# EAGLE board main_board (EAGLE 7.1.0)
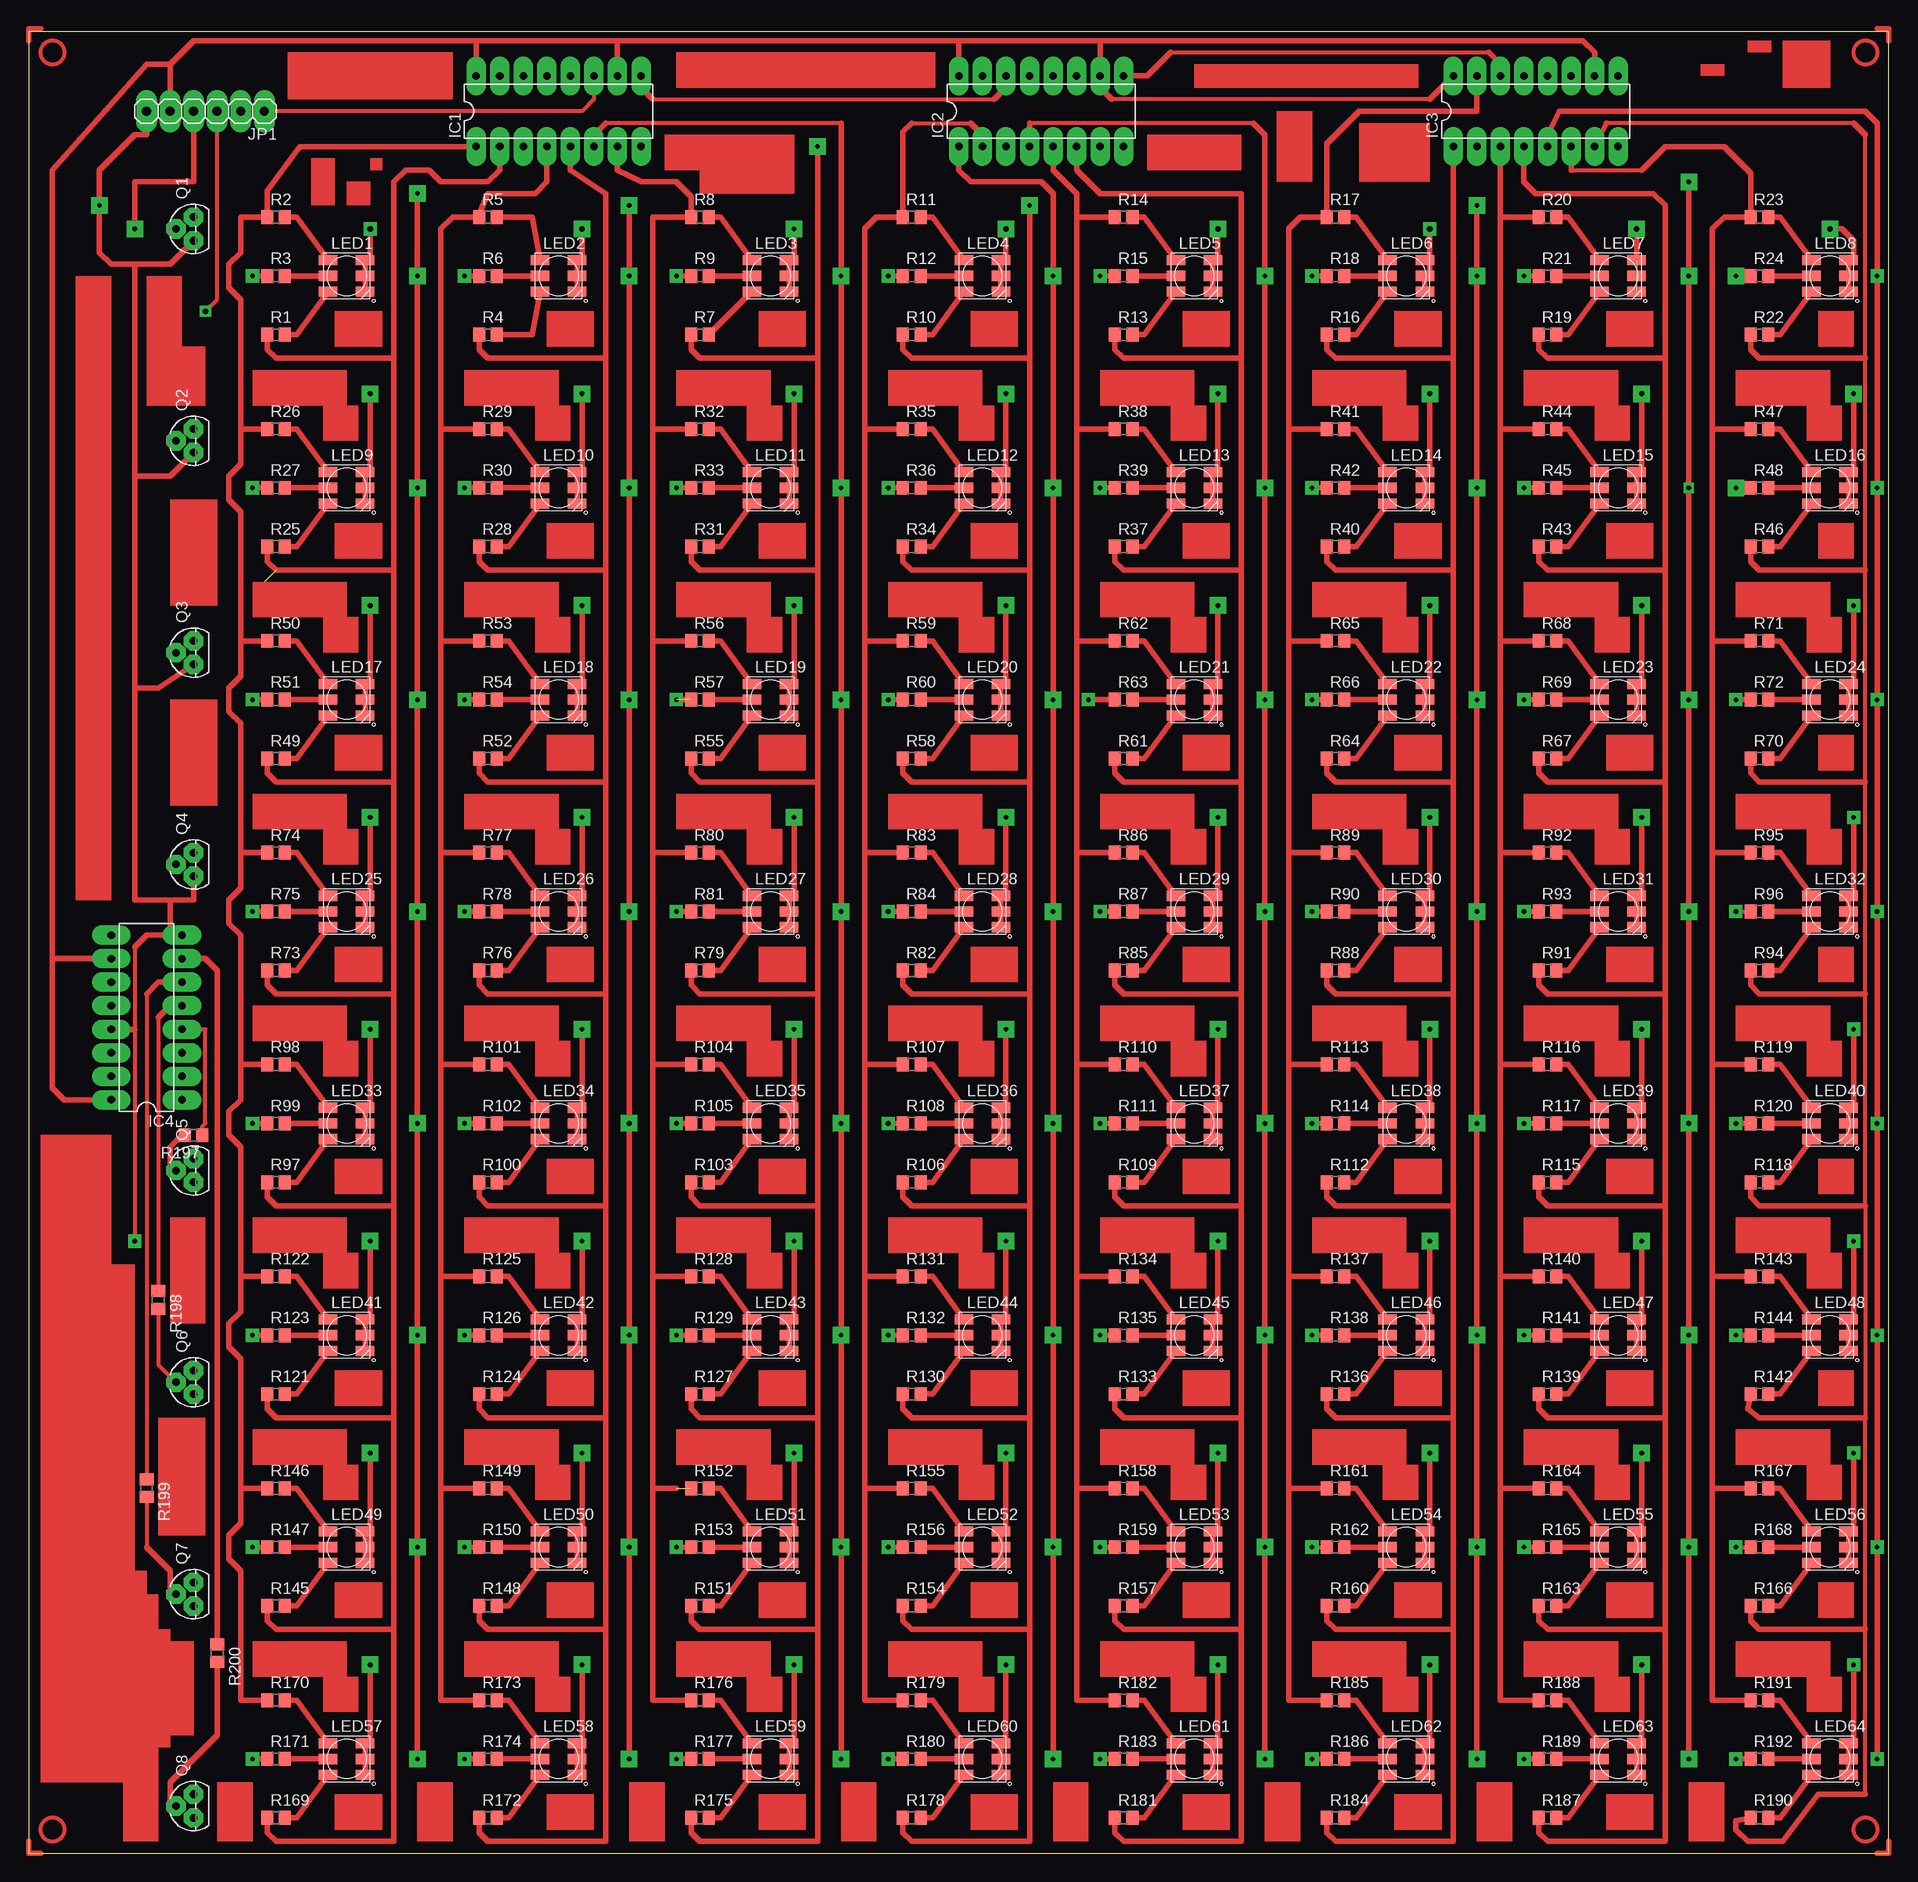
[diagram p1: board, top side]
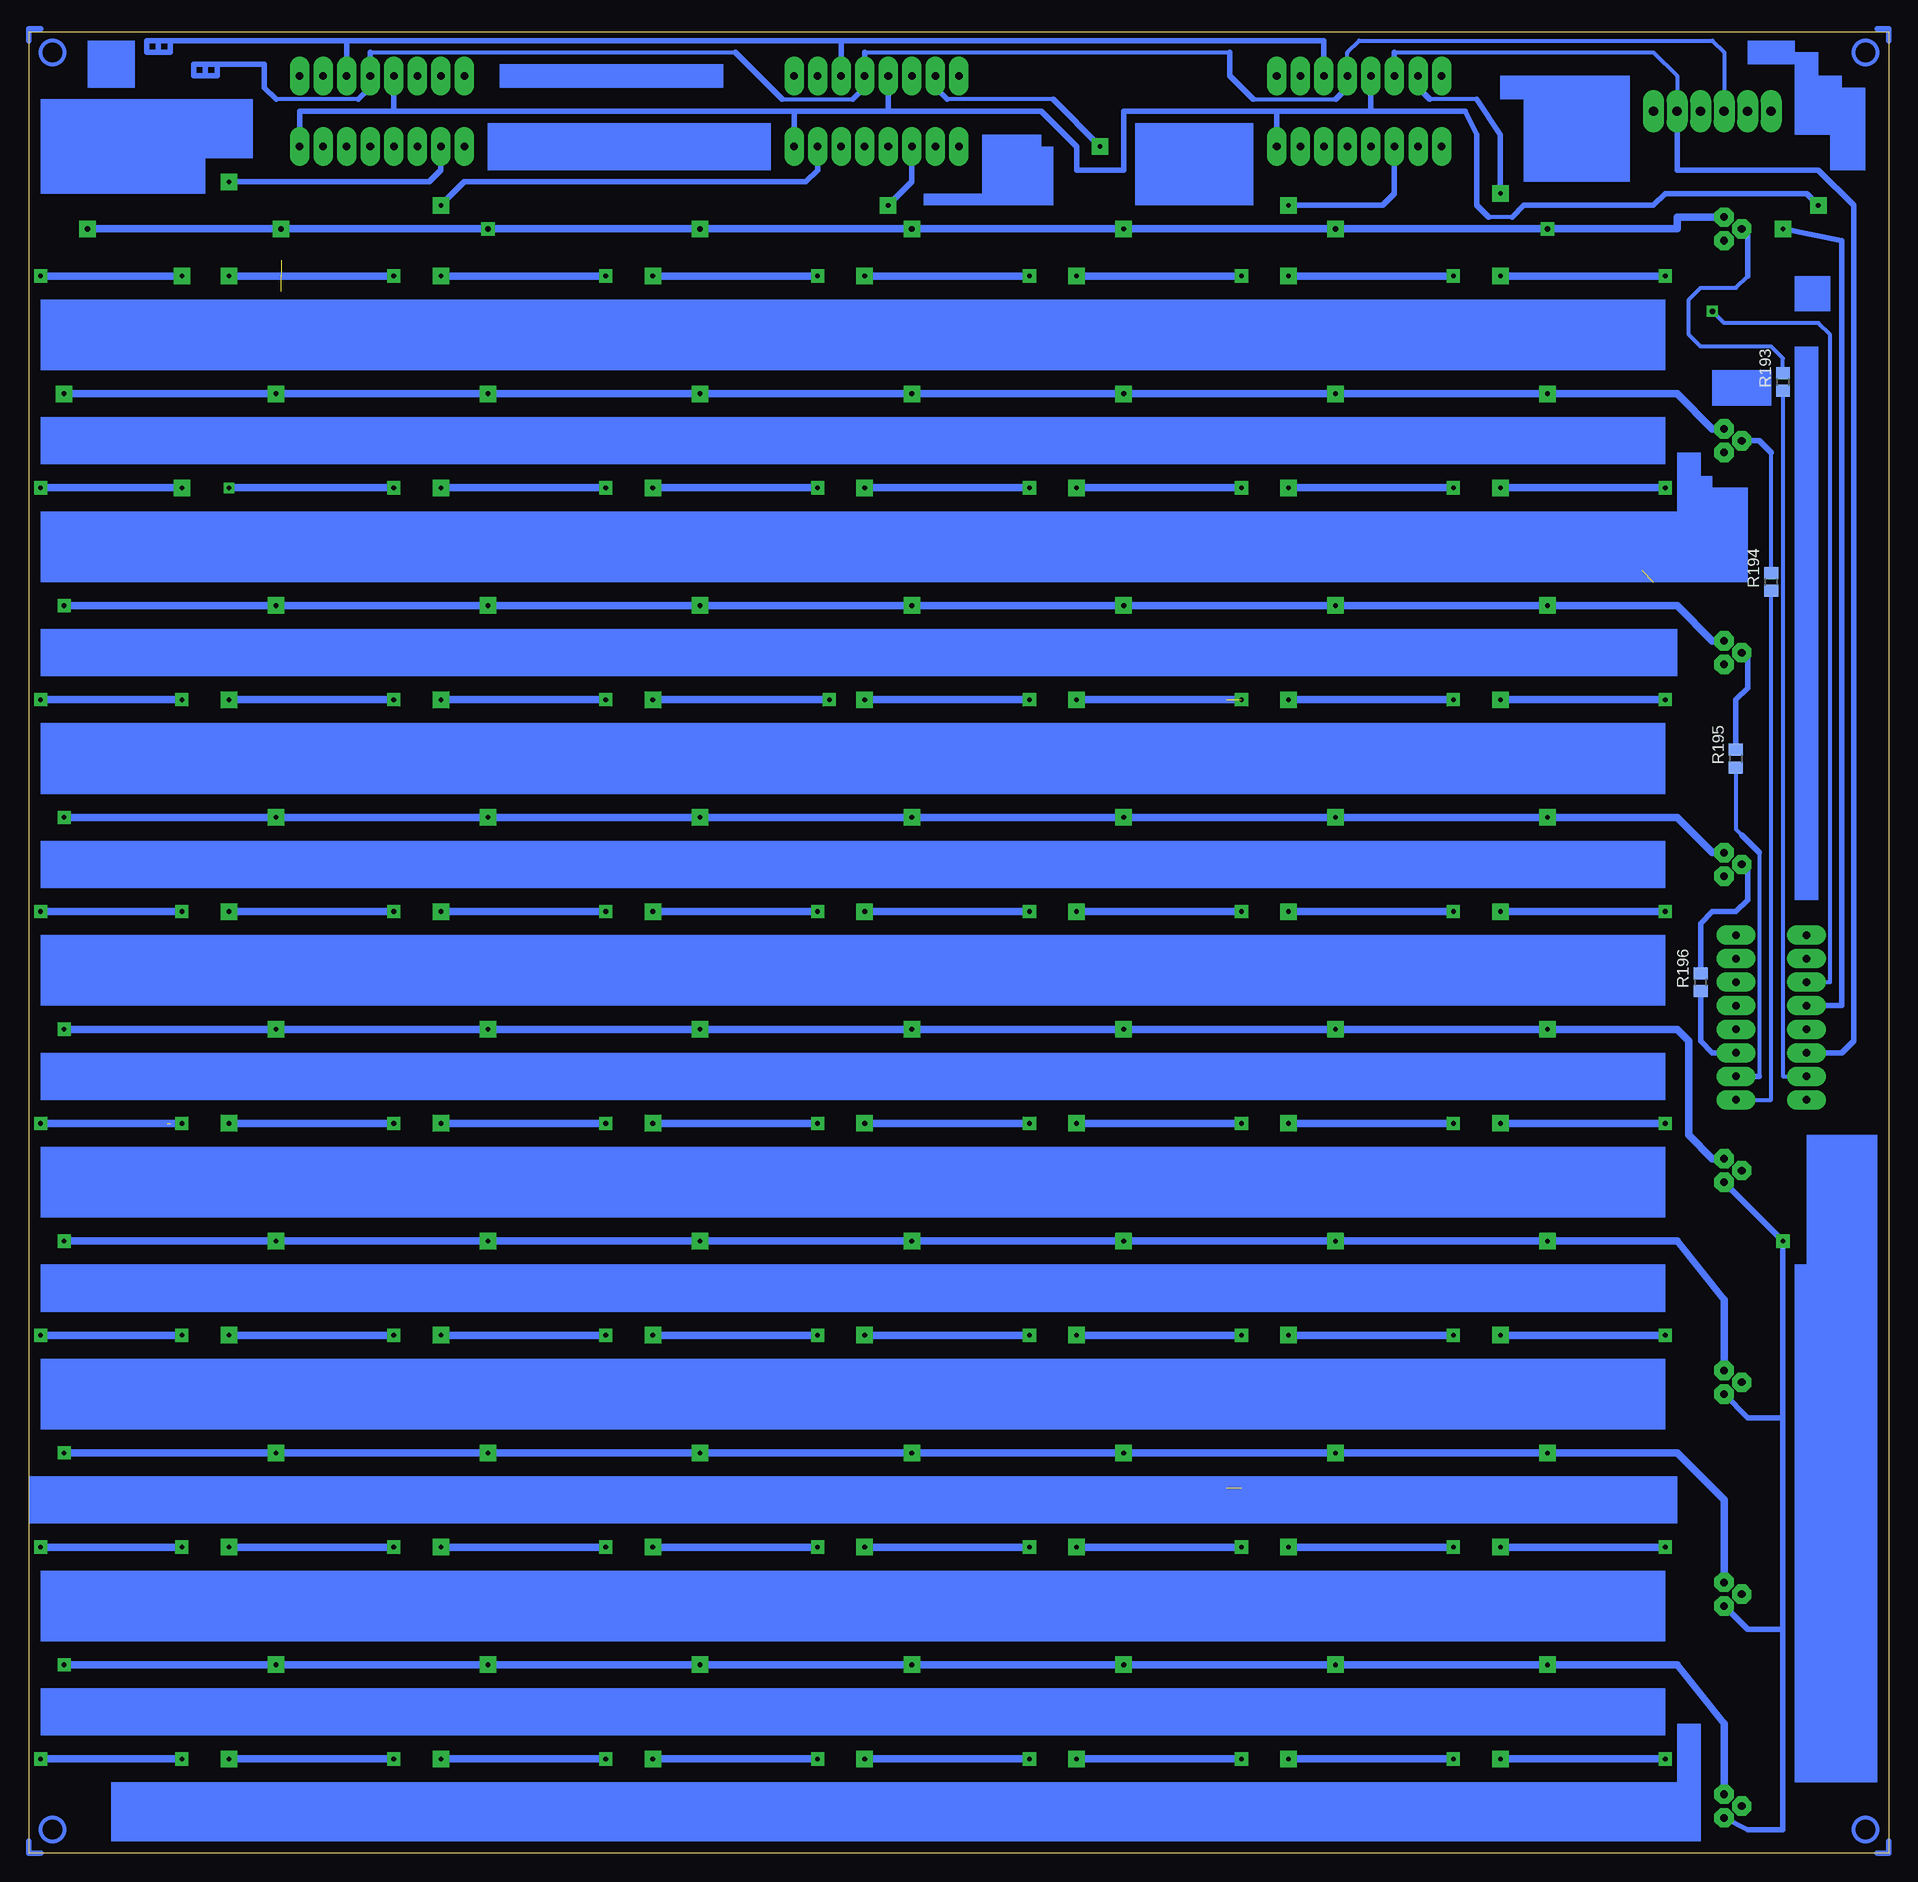
[diagram p2: board, bottom side, seen from below]

Size 200.64 x 196.52 mm. Coordinates in mm from the lower left corner, seen from the top.
Outline: 0,0 200.64,0 200.64,196.52 0,196.52 0,0
Copper layers (1*16): Top 0.035mm / dielectric 1.5mm / Bottom 0.035mm
Design rules "default": minimum track width 10mil, minimum drill 32mil, track to track 12mil, track to pad 12mil, pad to pad 12mil, via to via 12mil, smd to smd 8mil, copper to edge 40mil, drill to drill 40mil, minimum pad ring 25mil, minimum via ring 12mil, stop-mask expansion 4mil, vias tented up to drill 0mil, thermal gap 10mil

## Footprints (pad centres in the part's own frame; a part is rotated, then mirrored left to right if it is on the bottom)
DIL16 = drill 0.813 long: 1 -8.89,-3.81; 2 -6.35,-3.81; 3 -3.81,-3.81; 4 -1.27,-3.81; 5 1.27,-3.81; 6 3.81,-3.81; 7 6.35,-3.81; 8 8.89,-3.81; 9 8.89,3.81; 10 6.35,3.81; 11 3.81,3.81; 12 1.27,3.81; 13 -1.27,3.81; 14 -3.81,3.81; 15 -6.35,3.81; 16 -8.89,3.81
1X06 = drill 1.016 long: 1 -6.35,0; 2 -3.81,0; 3 -1.27,0; 4 1.27,0; 5 3.81,0; 6 6.35,0
RGBLED5050 = smd 2 x 1.1: 1 -2,1.7; 2 -2,0; 3 -2,-1.7; 4 2,-1.7; 5 2,0; 6 2,1.7
TO92 = drill 0.813 octagon: 1 1.27,0; 2 0,1.905; 3 -1.27,0
R0805 = smd 1.3 x 1.5: 1 -0.95,0; 2 0.95,0

## Placement (x,y rotation side)
IC1  74HC595N  [DIL16]  57.15,187.96 0 top
IC2  74HC595N  [DIL16]  109.22,187.96 0 top
IC3  74HC595N  [DIL16]  162.56,187.96 0 top
IC4  74HC595N  [DIL16]  12.7,90.17 90 top
JP1  [1X06]  19.05,187.96 180 top
LED1  RGBLED5050  [RGBLED5050]  34.29,170.18 0 top
LED2  RGBLED5050  [RGBLED5050]  57.15,170.18 0 top
LED3  RGBLED5050  [RGBLED5050]  80.01,170.18 0 top
LED4  RGBLED5050  [RGBLED5050]  102.87,170.18 0 top
LED5  RGBLED5050  [RGBLED5050]  125.73,170.18 0 top
LED6  RGBLED5050  [RGBLED5050]  148.59,170.18 0 top
LED7  RGBLED5050  [RGBLED5050]  171.45,170.18 0 top
LED8  RGBLED5050  [RGBLED5050]  194.31,170.18 0 top
LED9  RGBLED5050  [RGBLED5050]  34.29,147.32 0 top
LED10  RGBLED5050  [RGBLED5050]  57.15,147.32 0 top
LED11  RGBLED5050  [RGBLED5050]  80.01,147.32 0 top
LED12  RGBLED5050  [RGBLED5050]  102.87,147.32 0 top
LED13  RGBLED5050  [RGBLED5050]  125.73,147.32 0 top
LED14  RGBLED5050  [RGBLED5050]  148.59,147.32 0 top
LED15  RGBLED5050  [RGBLED5050]  171.45,147.32 0 top
LED16  RGBLED5050  [RGBLED5050]  194.31,147.32 0 top
LED17  RGBLED5050  [RGBLED5050]  34.29,124.46 0 top
LED18  RGBLED5050  [RGBLED5050]  57.15,124.46 0 top
LED19  RGBLED5050  [RGBLED5050]  80.01,124.46 0 top
LED20  RGBLED5050  [RGBLED5050]  102.87,124.46 0 top
LED21  RGBLED5050  [RGBLED5050]  125.73,124.46 0 top
LED22  RGBLED5050  [RGBLED5050]  148.59,124.46 0 top
LED23  RGBLED5050  [RGBLED5050]  171.45,124.46 0 top
LED24  RGBLED5050  [RGBLED5050]  194.31,124.46 0 top
LED25  RGBLED5050  [RGBLED5050]  34.29,101.6 0 top
LED26  RGBLED5050  [RGBLED5050]  57.15,101.6 0 top
LED27  RGBLED5050  [RGBLED5050]  80.01,101.6 0 top
LED28  RGBLED5050  [RGBLED5050]  102.87,101.6 0 top
LED29  RGBLED5050  [RGBLED5050]  125.73,101.6 0 top
LED30  RGBLED5050  [RGBLED5050]  148.59,101.6 0 top
LED31  RGBLED5050  [RGBLED5050]  171.45,101.6 0 top
LED32  RGBLED5050  [RGBLED5050]  194.31,101.6 0 top
LED33  RGBLED5050  [RGBLED5050]  34.29,78.74 0 top
LED34  RGBLED5050  [RGBLED5050]  57.15,78.74 0 top
LED35  RGBLED5050  [RGBLED5050]  80.01,78.74 0 top
LED36  RGBLED5050  [RGBLED5050]  102.87,78.74 0 top
LED37  RGBLED5050  [RGBLED5050]  125.73,78.74 0 top
LED38  RGBLED5050  [RGBLED5050]  148.59,78.74 0 top
LED39  RGBLED5050  [RGBLED5050]  171.45,78.74 0 top
LED40  RGBLED5050  [RGBLED5050]  194.31,78.74 0 top
LED41  RGBLED5050  [RGBLED5050]  34.29,55.88 0 top
LED42  RGBLED5050  [RGBLED5050]  57.15,55.88 0 top
LED43  RGBLED5050  [RGBLED5050]  80.01,55.88 0 top
LED44  RGBLED5050  [RGBLED5050]  102.87,55.88 0 top
LED45  RGBLED5050  [RGBLED5050]  125.73,55.88 0 top
LED46  RGBLED5050  [RGBLED5050]  148.59,55.88 0 top
LED47  RGBLED5050  [RGBLED5050]  171.45,55.88 0 top
LED48  RGBLED5050  [RGBLED5050]  194.31,55.88 0 top
LED49  RGBLED5050  [RGBLED5050]  34.29,33.02 0 top
LED50  RGBLED5050  [RGBLED5050]  57.15,33.02 0 top
LED51  RGBLED5050  [RGBLED5050]  80.01,33.02 0 top
LED52  RGBLED5050  [RGBLED5050]  102.87,33.02 0 top
LED53  RGBLED5050  [RGBLED5050]  125.73,33.02 0 top
LED54  RGBLED5050  [RGBLED5050]  148.59,33.02 0 top
LED55  RGBLED5050  [RGBLED5050]  171.45,33.02 0 top
LED56  RGBLED5050  [RGBLED5050]  194.31,33.02 0 top
LED57  RGBLED5050  [RGBLED5050]  34.29,10.16 0 top
LED58  RGBLED5050  [RGBLED5050]  57.15,10.16 0 top
LED59  RGBLED5050  [RGBLED5050]  80.01,10.16 0 top
LED60  RGBLED5050  [RGBLED5050]  102.87,10.16 0 top
LED61  RGBLED5050  [RGBLED5050]  125.73,10.16 0 top
LED62  RGBLED5050  [RGBLED5050]  148.59,10.16 0 top
LED63  RGBLED5050  [RGBLED5050]  171.45,10.16 0 top
LED64  RGBLED5050  [RGBLED5050]  194.31,10.16 0 top
Q1  BC557  [TO92]  17.78,175.26 90 top
Q2  BC557  [TO92]  17.78,152.4 90 top
Q3  BC557  [TO92]  17.78,129.54 90 top
Q4  BC557  [TO92]  17.78,106.68 90 top
Q5  BC557  [TO92]  17.78,73.66 90 top
Q6  BC557  [TO92]  17.78,50.8 90 top
Q7  BC557  [TO92]  17.78,27.94 90 top
Q8  BC557  [TO92]  17.78,5.08 90 top
R1  [R0805]  26.67,163.83 0 top
R2  [R0805]  26.67,176.53 0 top
R3  [R0805]  26.67,170.18 0 top
R4  [R0805]  49.53,163.83 0 top
R5  [R0805]  49.53,176.53 0 top
R6  [R0805]  49.53,170.18 0 top
R7  [R0805]  72.39,163.83 0 top
R8  [R0805]  72.39,176.53 0 top
R9  [R0805]  72.39,170.18 0 top
R10  [R0805]  95.25,163.83 0 top
R11  [R0805]  95.25,176.53 0 top
R12  [R0805]  95.25,170.18 0 top
R13  [R0805]  118.11,163.83 0 top
R14  [R0805]  118.11,176.53 0 top
R15  [R0805]  118.11,170.18 0 top
R16  [R0805]  140.97,163.83 0 top
R17  [R0805]  140.97,176.53 0 top
R18  [R0805]  140.97,170.18 0 top
R19  [R0805]  163.83,163.83 0 top
R20  [R0805]  163.83,176.53 0 top
R21  [R0805]  163.83,170.18 0 top
R22  [R0805]  186.69,163.83 0 top
R23  [R0805]  186.69,176.53 0 top
R24  [R0805]  186.69,170.18 0 top
R25  [R0805]  26.67,140.97 0 top
R26  [R0805]  26.67,153.67 0 top
R27  [R0805]  26.67,147.32 0 top
R28  [R0805]  49.53,140.97 0 top
R29  [R0805]  49.53,153.67 0 top
R30  [R0805]  49.53,147.32 0 top
R31  [R0805]  72.39,140.97 0 top
R32  [R0805]  72.39,153.67 0 top
R33  [R0805]  72.39,147.32 0 top
R34  [R0805]  95.25,140.97 0 top
R35  [R0805]  95.25,153.67 0 top
R36  [R0805]  95.25,147.32 0 top
R37  [R0805]  118.11,140.97 0 top
R38  [R0805]  118.11,153.67 0 top
R39  [R0805]  118.11,147.32 0 top
R40  [R0805]  140.97,140.97 0 top
R41  [R0805]  140.97,153.67 0 top
R42  [R0805]  140.97,147.32 0 top
R43  [R0805]  163.83,140.97 0 top
R44  [R0805]  163.83,153.67 0 top
R45  [R0805]  163.83,147.32 0 top
R46  [R0805]  186.69,140.97 0 top
R47  [R0805]  186.69,153.67 0 top
R48  [R0805]  186.69,147.32 0 top
R49  [R0805]  26.67,118.11 0 top
R50  [R0805]  26.67,130.81 0 top
R51  [R0805]  26.67,124.46 0 top
R52  [R0805]  49.53,118.11 0 top
R53  [R0805]  49.53,130.81 0 top
R54  [R0805]  49.53,124.46 0 top
R55  [R0805]  72.39,118.11 0 top
R56  [R0805]  72.39,130.81 0 top
R57  [R0805]  72.39,124.46 0 top
R58  [R0805]  95.25,118.11 0 top
R59  [R0805]  95.25,130.81 0 top
R60  [R0805]  95.25,124.46 0 top
R61  [R0805]  118.11,118.11 0 top
R62  [R0805]  118.11,130.81 0 top
R63  [R0805]  118.11,124.46 0 top
R64  [R0805]  140.97,118.11 0 top
R65  [R0805]  140.97,130.81 0 top
R66  [R0805]  140.97,124.46 0 top
R67  [R0805]  163.83,118.11 0 top
R68  [R0805]  163.83,130.81 0 top
R69  [R0805]  163.83,124.46 0 top
R70  [R0805]  186.69,118.11 0 top
R71  [R0805]  186.69,130.81 0 top
R72  [R0805]  186.69,124.46 0 top
R73  [R0805]  26.67,95.25 0 top
R74  [R0805]  26.67,107.95 0 top
R75  [R0805]  26.67,101.6 0 top
R76  [R0805]  49.53,95.25 0 top
R77  [R0805]  49.53,107.95 0 top
R78  [R0805]  49.53,101.6 0 top
R79  [R0805]  72.39,95.25 0 top
R80  [R0805]  72.39,107.95 0 top
R81  [R0805]  72.39,101.6 0 top
R82  [R0805]  95.25,95.25 0 top
R83  [R0805]  95.25,107.95 0 top
R84  [R0805]  95.25,101.6 0 top
R85  [R0805]  118.11,95.25 0 top
R86  [R0805]  118.11,107.95 0 top
R87  [R0805]  118.11,101.6 0 top
R88  [R0805]  140.97,95.25 0 top
R89  [R0805]  140.97,107.95 0 top
R90  [R0805]  140.97,101.6 0 top
R91  [R0805]  163.83,95.25 0 top
R92  [R0805]  163.83,107.95 0 top
R93  [R0805]  163.83,101.6 0 top
R94  [R0805]  186.69,95.25 0 top
R95  [R0805]  186.69,107.95 0 top
R96  [R0805]  186.69,101.6 0 top
R97  [R0805]  26.67,72.39 0 top
R98  [R0805]  26.67,85.09 0 top
R99  [R0805]  26.67,78.74 0 top
R100  [R0805]  49.53,72.39 0 top
R101  [R0805]  49.53,85.09 0 top
R102  [R0805]  49.53,78.74 0 top
R103  [R0805]  72.39,72.39 0 top
R104  [R0805]  72.39,85.09 0 top
R105  [R0805]  72.39,78.74 0 top
R106  [R0805]  95.25,72.39 0 top
R107  [R0805]  95.25,85.09 0 top
R108  [R0805]  95.25,78.74 0 top
R109  [R0805]  118.11,72.39 0 top
R110  [R0805]  118.11,85.09 0 top
R111  [R0805]  118.11,78.74 0 top
R112  [R0805]  140.97,72.39 0 top
R113  [R0805]  140.97,85.09 0 top
R114  [R0805]  140.97,78.74 0 top
R115  [R0805]  163.83,72.39 0 top
R116  [R0805]  163.83,85.09 0 top
R117  [R0805]  163.83,78.74 0 top
R118  [R0805]  186.69,72.39 0 top
R119  [R0805]  186.69,85.09 0 top
R120  [R0805]  186.69,78.74 0 top
R121  [R0805]  26.67,49.53 0 top
R122  [R0805]  26.67,62.23 0 top
R123  [R0805]  26.67,55.88 0 top
R124  [R0805]  49.53,49.53 0 top
R125  [R0805]  49.53,62.23 0 top
R126  [R0805]  49.53,55.88 0 top
R127  [R0805]  72.39,49.53 0 top
R128  [R0805]  72.39,62.23 0 top
R129  [R0805]  72.39,55.88 0 top
R130  [R0805]  95.25,49.53 0 top
R131  [R0805]  95.25,62.23 0 top
R132  [R0805]  95.25,55.88 0 top
R133  [R0805]  118.11,49.53 0 top
R134  [R0805]  118.11,62.23 0 top
R135  [R0805]  118.11,55.88 0 top
R136  [R0805]  140.97,49.53 0 top
R137  [R0805]  140.97,62.23 0 top
R138  [R0805]  140.97,55.88 0 top
R139  [R0805]  163.83,49.53 0 top
R140  [R0805]  163.83,62.23 0 top
R141  [R0805]  163.83,55.88 0 top
R142  [R0805]  186.69,49.53 0 top
R143  [R0805]  186.69,62.23 0 top
R144  [R0805]  186.69,55.88 0 top
R145  [R0805]  26.67,26.67 0 top
R146  [R0805]  26.67,39.37 0 top
R147  [R0805]  26.67,33.02 0 top
R148  [R0805]  49.53,26.67 0 top
R149  [R0805]  49.53,39.37 0 top
R150  [R0805]  49.53,33.02 0 top
R151  [R0805]  72.39,26.67 0 top
R152  [R0805]  72.39,39.37 0 top
R153  [R0805]  72.39,33.02 0 top
R154  [R0805]  95.25,26.67 0 top
R155  [R0805]  95.25,39.37 0 top
R156  [R0805]  95.25,33.02 0 top
R157  [R0805]  118.11,26.67 0 top
R158  [R0805]  118.11,39.37 0 top
R159  [R0805]  118.11,33.02 0 top
R160  [R0805]  140.97,26.67 0 top
R161  [R0805]  140.97,39.37 0 top
R162  [R0805]  140.97,33.02 0 top
R163  [R0805]  163.83,26.67 0 top
R164  [R0805]  163.83,39.37 0 top
R165  [R0805]  163.83,33.02 0 top
R166  [R0805]  186.69,26.67 0 top
R167  [R0805]  186.69,39.37 0 top
R168  [R0805]  186.69,33.02 0 top
R169  [R0805]  26.67,3.81 0 top
R170  [R0805]  26.67,16.51 0 top
R171  [R0805]  26.67,10.16 0 top
R172  [R0805]  49.53,3.81 0 top
R173  [R0805]  49.53,16.51 0 top
R174  [R0805]  49.53,10.16 0 top
R175  [R0805]  72.39,3.81 0 top
R176  [R0805]  72.39,16.51 0 top
R177  [R0805]  72.39,10.16 0 top
R178  [R0805]  95.25,3.81 0 top
R179  [R0805]  95.25,16.51 0 top
R180  [R0805]  95.25,10.16 0 top
R181  [R0805]  118.11,3.81 0 top
R182  [R0805]  118.11,16.51 0 top
R183  [R0805]  118.11,10.16 0 top
R184  [R0805]  140.97,3.81 0 top
R185  [R0805]  140.97,16.51 0 top
R186  [R0805]  140.97,10.16 0 top
R187  [R0805]  163.83,3.81 0 top
R188  [R0805]  163.83,16.51 0 top
R189  [R0805]  163.83,10.16 0 top
R190  [R0805]  186.69,3.81 0 top
R191  [R0805]  186.69,16.51 0 top
R192  [R0805]  186.69,10.16 0 top
R193  [R0805]  11.43,158.75 90 bottom
R194  [R0805]  12.7,137.16 90 bottom
R195  [R0805]  16.51,118.11 90 bottom
R196  [R0805]  20.32,93.98 90 bottom
R197  [R0805]  17.78,77.47 180 top
R198  [R0805]  13.97,59.69 270 top
R199  [R0805]  12.7,39.37 270 top
R200  [R0805]  20.32,21.59 270 top

## Tracks (layer width: path | path; a pad name or v marks a point on that pad's centre or on a via)
1-COLUMN_SET_CLK
  Top 0.406: IC1.11 60.96,189.23 59.69,187.96 JP1.1
  Bottom 0.61: 166.37,195.58 113.03,195.58 | IC2.11 113.03,195.58 | 113.03,195.58 60.96,195.58 IC1.11 | IC3.11 166.37,195.58 | 166.37,195.58 185.42,195.58 | 186.69,195.58 186.69,194.31 | 186.69,194.31 187.96,194.31 187.96,195.58 186.69,195.58 | 186.69,195.58 185.42,195.58 | 185.42,195.58 185.42,194.31 186.69,194.31
2-DATA
  Bottom 0.406: 53.34,194.31 25.4,194.31 22.86,191.77 JP1.2
  Bottom 0.61: IC4.14 5.08,86.36 3.81,87.63 3.81,177.8 7.62,181.61 22.86,181.61 JP1.2 | IC1.14 53.34,194.31
3-ROW_SET_CLK  (via drill 0.6)
  Top 0.406: v19.05,166.37 20.32,167.64 JP1.3
  Bottom 0.406: IC4.11 6.35,93.98 6.35,163.83 7.62,165.1 17.78,165.1 v19.05,166.37
4-LATCH  (via drill 0.5 pad 1.78)
  Top 0.61: v11.43,175.26 11.43,180.34 17.78,180.34 JP1.4
  Bottom 0.406: 110.49,194.31 71.12,194.31 | 68.58,189.23 59.69,189.23 | 163.83,194.31 124.46,194.31 | 119.38,189.23 111.76,189.23 | 165.1,189.23 173.99,189.23 | IC1.12 58.42,194.31 57.15,195.58 19.05,195.58 17.78,194.31 JP1.4
  Bottom 0.61: 110.49,194.31 IC2.12 110.49,190.5 111.76,189.23 | 71.12,194.31 71.12,191.77 68.58,189.23 | 59.69,189.23 58.42,190.5 IC1.12 | 163.83,194.31 IC3.12 163.83,190.5 165.1,189.23 | 124.46,194.31 119.38,189.23 | IC4.12 5.08,91.44 5.08,173.99 v11.43,175.26 | 173.99,189.23 175.26,190.5 175.26,193.04 180.34,193.04 | 181.61,193.04 182.88,193.04 182.88,191.77 181.61,191.77 | 181.61,191.77 181.61,193.04 | 181.61,193.04 180.34,193.04 | 180.34,193.04 180.34,191.77 181.61,191.77
+5V
  Top 0.406: 151.13,189.23 116.84,189.23
  Top 0.61: IC3.10 168.91,194.31 167.64,195.58 115.57,195.58 | 115.57,195.58 IC2.10 115.57,190.5 116.84,189.23 | 115.57,195.58 100.33,195.58 | IC2.16 100.33,195.58 | 100.33,195.58 63.5,195.58 | IC1.10 63.5,195.58 | 63.5,195.58 48.26,195.58 | IC1.16 48.26,195.58 | 48.26,195.58 17.78,195.58 15.24,193.04 | IC3.16 151.13,189.23 | IC4.10 2.54,96.52 | 2.54,96.52 2.54,82.55 3.81,81.28 IC4.16 | JP1.5 15.24,193.04 | 15.24,193.04 12.7,193.04 2.54,181.61 2.54,96.52
GND  (via drill 0.5 pad 1.42, 0.5 pad 1.78)
  Top 0.406: 11.43,97.79 11.43,88.9 v11.43,66.04
  Top 0.61: 15.24,102.87 11.43,102.87 11.43,125.73 | Q3.3 13.97,125.73 11.43,125.73 | Q2.3 15.24,148.59 11.43,148.59 | 11.43,148.59 11.43,125.73 | 11.43,171.45 11.43,148.59 | Q1.3 15.24,171.45 11.43,171.45 | 15.24,102.87 15.24,99.06 IC4.8 12.7,99.06 11.43,97.79 | IC4.13 11.43,88.9 | 11.43,171.45 8.89,171.45 7.62,172.72 v7.62,177.8 7.62,181.61 11.43,185.42 12.7,185.42 JP1.6 | Q4.3 17.78,102.87 15.24,102.87
  Bottom 0.406: 40.64,176.53 43.18,176.53
  Bottom 0.61: 66.04,187.96 55.88,187.96 | 55.88,187.96 45.72,187.96 44.45,185.42 44.45,177.8 43.18,176.53 | IC1.8 66.04,187.96 | 66.04,187.96 82.55,187.96 82.55,181.61 87.63,181.61 87.63,184.15 91.44,187.96 107.95,187.96 | 107.95,187.96 118.11,187.96 | 118.11,186.69 IC2.8 118.11,187.96 | 118.11,187.96 161.29,187.96 | 161.29,187.96 171.45,187.96 IC3.8 | IC1.13 55.88,187.96 | IC2.13 107.95,187.96 | IC3.13 161.29,187.96 | Q5.3 v11.43,66.04 11.43,46.99 | 11.43,46.99 15.24,46.99 Q6.3 | Q7.3 15.24,24.13 11.43,24.13 | 11.43,24.13 11.43,46.99 | Q8.3 15.24,2.54 11.43,2.54 11.43,24.13 | 40.64,176.53 39.37,177.8 25.4,177.8 24.13,179.07 8.89,179.07 v7.62,177.8
N$1
  Top 0.61: R200.2 20.32,12.7 15.24,7.62 15.24,5.71 Q8.2
N$3
  Top 0.61: R169.2 28.91,3.81 LED57.3
N$4
  Top 0.61: R170.2 28.91,16.51 LED57.1
N$5
  Top 0.61: R171.2 LED57.2
N$6
  Top 0.61: R172.2 51.77,3.81 LED58.3
N$8
  Top 0.61: R173.2 51.77,16.51 LED58.1
N$9
  Top 0.406: 95.25,186.69 101.6,186.69
  Top 0.61: 90.17,153.67 90.17,175.26 91.44,176.53 R11.1 94.3,185.74 95.25,186.69 | R35.1 90.17,153.67 | 90.17,153.67 90.17,130.81 | R59.1 90.17,130.81 | 90.17,130.81 90.17,107.95 | R83.1 90.17,107.95 | 90.17,107.95 90.17,85.09 | R107.1 90.17,85.09 | 90.17,85.09 90.17,62.23 | R131.1 90.17,62.23 | 90.17,62.23 90.17,39.37 | R155.1 90.17,39.37 | 90.17,39.37 90.17,16.51 R179.1 | 101.6,186.69 102.87,185.42 IC2.2
N$10
  Top 0.61: R174.2 LED58.2
N$11
  Top 0.61: R176.2 74.63,16.51 LED59.1
N$12
  Top 0.61: R177.2 LED59.2
N$13
  Top 0.61: R175.2 74.63,3.81 LED59.3
N$14
  Top 0.61: R1.2 28.91,163.83 LED1.3
N$15
  Top 0.61: R2.2 28.91,176.53 LED1.1
N$16
  Top 0.61: R3.2 LED1.2
N$17
  Top 0.61: R4.2 54.31,163.83 LED2.3
N$18
  Top 0.61: R5.2 54.31,176.53 LED2.1
N$19
  Top 0.61: R6.2 LED2.2
N$20
  Top 0.61: R7.2 73.36,163.83 LED3.3
N$21
  Top 0.61: R8.2 74.63,176.53 LED3.1
N$22
  Top 0.61: R9.2 LED3.2
N$23
  Top 0.61: R10.2 97.49,163.83 LED4.3
N$24
  Top 0.61: R11.2 97.49,176.53 LED4.1
N$25
  Top 0.61: R12.2 LED4.2
N$26
  Top 0.61: R13.2 120.35,163.83 LED5.3
N$27
  Top 0.61: R14.2 120.35,176.53 LED5.1
N$28
  Top 0.61: R15.2 LED5.2
N$29
  Top 0.61: R19.2 166.07,163.83 LED7.3
N$30
  Top 0.61: R20.2 166.07,176.53 LED7.1
N$31
  Top 0.61: R21.2 LED7.2
N$32
  Top 0.61: R22.2 188.93,163.83 LED8.3
N$33
  Top 0.61: R23.2 188.93,176.53 LED8.1
N$34
  Top 0.61: R24.2 LED8.2
N$35
  Top 0.61: R25.2 28.91,140.97 LED9.3
N$36
  Top 0.61: R26.2 28.91,153.67 LED9.1
N$37
  Top 0.61: R27.2 LED9.2
N$38
  Top 0.61: R28.2 51.77,140.97 LED10.3
N$39
  Top 0.61: R29.2 51.77,153.67 LED10.1
N$40
  Top 0.61: R30.2 LED10.2
N$41
  Top 0.61: R31.2 74.63,140.97 LED11.3
N$42
  Top 0.61: R32.2 74.63,153.67 LED11.1
N$43
  Top 0.61: R33.2 LED11.2
N$44
  Top 0.61: R34.2 97.49,140.97 LED12.3
N$45
  Top 0.61: R35.2 97.49,153.67 LED12.1
N$46
  Top 0.61: R36.2 LED12.2
N$47
  Top 0.61: R37.2 120.35,140.97 LED13.3
N$48
  Top 0.61: R38.2 120.35,153.67 LED13.1
N$49
  Top 0.61: R39.2 LED13.2
N$50
  Top 0.61: R16.2 143.21,163.83 LED6.3
N$51
  Top 0.61: R17.2 143.21,176.53 LED6.1
N$52
  Top 0.61: R18.2 LED6.2
N$53
  Top 0.61: R40.2 143.21,140.97 LED14.3
N$54
  Top 0.61: R41.2 143.21,153.67 LED14.1
N$55
  Top 0.61: R42.2 LED14.2
N$56
  Top 0.61: R49.2 28.91,118.11 LED17.3
N$57
  Top 0.61: R50.2 28.91,130.81 LED17.1
N$58
  Top 0.61: R51.2 LED17.2
N$59
  Top 0.61: R43.2 166.07,140.97 LED15.3
N$60
  Top 0.61: R44.2 166.07,153.67 LED15.1
N$61
  Top 0.61: R45.2 LED15.2
N$62
  Top 0.61: R46.2 188.93,140.97 LED16.3
N$63
  Top 0.61: R47.2 188.93,153.67 LED16.1
N$64
  Top 0.61: R48.2 LED16.2
N$65
  Top 0.61: R52.2 51.77,118.11 LED18.3
N$66
  Top 0.61: R53.2 51.77,130.81 LED18.1
N$67
  Top 0.61: R54.2 LED18.2
N$68
  Top 0.61: R55.2 74.63,118.11 LED19.3
N$69
  Top 0.61: R56.2 74.63,130.81 LED19.1
N$70
  Top 0.61: R57.2 LED19.2
N$71
  Top 0.61: R58.2 97.49,118.11 LED20.3
N$72
  Top 0.61: R59.2 97.49,130.81 LED20.1
N$73
  Top 0.61: R60.2 LED20.2
N$74
  Top 0.61: R61.2 120.35,118.11 LED21.3
N$75
  Top 0.61: R62.2 120.35,130.81 LED21.1
N$76
  Top 0.61: R63.2 LED21.2
N$77
  Top 0.61: R64.2 143.21,118.11 LED22.3
N$78
  Top 0.61: R65.2 143.21,130.81 LED22.1
N$79
  Top 0.61: R66.2 LED22.2
N$80
  Top 0.61: R67.2 166.07,118.11 LED23.3
N$81
  Top 0.61: R68.2 166.07,130.81 LED23.1
N$82
  Top 0.61: R69.2 LED23.2
N$83
  Top 0.61: R70.2 188.93,118.11 LED24.3
N$84
  Top 0.61: R71.2 188.93,130.81 LED24.1
N$85
  Top 0.61: LED24.2 R72.2
N$86
  Top 0.61: R73.2 28.91,95.25 LED25.3
N$87
  Top 0.61: R74.2 28.91,107.95 LED25.1
N$88
  Top 0.61: R75.2 LED25.2
N$89
  Top 0.61: R76.2 51.77,95.25 LED26.3
N$90
  Top 0.61: R77.2 51.77,107.95 LED26.1
N$91
  Top 0.61: R78.2 LED26.2
N$92
  Top 0.61: R79.2 74.63,95.25 LED27.3
N$93
  Top 0.61: R80.2 74.63,107.95 LED27.1
N$94
  Top 0.61: R81.2 LED27.2
N$95
  Top 0.61: R82.2 97.49,95.25 LED28.3
N$96
  Top 0.61: R83.2 97.49,107.95 LED28.1
N$97
  Top 0.61: R84.2 LED28.2
N$98
  Top 0.61: R85.2 120.35,95.25 LED29.3
N$99
  Top 0.61: R86.2 120.35,107.95 LED29.1
N$100
  Top 0.61: R87.2 LED29.2
N$101
  Top 0.61: R88.2 143.21,95.25 LED30.3
N$102
  Top 0.61: R89.2 143.21,107.95 LED30.1
N$103
  Top 0.61: R90.2 LED30.2
N$104
  Top 0.61: R93.2 LED31.2
N$105
  Top 0.61: R92.2 166.07,107.95 LED31.1
N$106
  Top 0.61: R91.2 166.07,95.25 LED31.3
N$107
  Top 0.61: R96.2 LED32.2
N$108
  Top 0.61: R95.2 188.93,107.95 LED32.1
N$109
  Top 0.61: R94.2 188.93,95.25 LED32.3
N$110
  Top 0.61: R97.2 28.91,72.39 LED33.3
N$111
  Top 0.61: R98.2 28.91,85.09 LED33.1
N$112
  Top 0.61: R99.2 LED33.2
N$113
  Top 0.61: R100.2 51.77,72.39 LED34.3
N$114
  Top 0.61: R101.2 51.77,85.09 LED34.1
N$115
  Top 0.61: R102.2 LED34.2
N$116
  Top 0.61: R103.2 74.63,72.39 LED35.3
N$117
  Top 0.61: R104.2 74.63,85.09 LED35.1
N$118
  Top 0.61: R105.2 LED35.2
N$119
  Top 0.61: R106.2 97.49,72.39 LED36.3
N$120
  Top 0.61: R107.2 97.49,85.09 LED36.1
N$121
  Top 0.61: R108.2 LED36.2
N$122
  Top 0.61: R109.2 120.35,72.39 LED37.3
N$123
  Top 0.61: R110.2 120.35,85.09 LED37.1
N$124
  Top 0.61: R111.2 LED37.2
N$125
  Top 0.61: R112.2 143.21,72.39 LED38.3
N$126
  Top 0.61: R113.2 143.21,85.09 LED38.1
N$127
  Top 0.61: R114.2 LED38.2
N$128
  Top 0.61: R115.2 166.07,72.39 LED39.3
N$129
  Top 0.61: R116.2 166.07,85.09 LED39.1
N$130
  Top 0.61: R117.2 LED39.2
N$131
  Top 0.61: R118.2 188.93,72.39 LED40.3
N$132
  Top 0.61: R119.2 188.93,85.09 LED40.1
N$133
  Top 0.61: R120.2 LED40.2
N$134
  Top 0.61: R121.2 28.91,49.53 LED41.3
N$135
  Top 0.61: R122.2 28.91,62.23 LED41.1
N$136
  Top 0.61: R123.2 LED41.2
N$137
  Top 0.61: R124.2 51.77,49.53 LED42.3
N$138
  Top 0.61: R125.2 51.77,62.23 LED42.1
N$139
  Top 0.61: R126.2 LED42.2
N$140
  Top 0.61: R127.2 74.63,49.53 LED43.3
N$141
  Top 0.61: R128.2 74.63,62.23 LED43.1
N$142
  Top 0.61: R129.2 LED43.2
N$143
  Top 0.61: R130.2 97.49,49.53 LED44.3
N$144
  Top 0.61: R131.2 97.49,62.23 LED44.1
N$145
  Top 0.61: R132.2 LED44.2
N$146
  Top 0.61: R133.2 120.35,49.53 LED45.3
N$147
  Top 0.61: R134.2 120.35,62.23 LED45.1
N$148
  Top 0.61: R135.2 LED45.2
N$149
  Top 0.61: R136.2 143.21,49.53 LED46.3
N$150
  Top 0.61: R137.2 143.21,62.23 LED46.1
N$151
  Top 0.61: R138.2 LED46.2
N$152
  Top 0.61: R139.2 166.07,49.53 LED47.3
N$153
  Top 0.61: R140.2 166.07,62.23 LED47.1
N$154
  Top 0.61: R141.2 LED47.2
N$155
  Top 0.61: R142.2 188.93,49.53 LED48.3
N$156
  Top 0.61: R143.2 188.93,62.23 LED48.1
N$157
  Top 0.61: R144.2 LED48.2
N$158
  Top 0.61: R145.2 28.91,26.67 LED49.3
N$159
  Top 0.61: R146.2 28.91,39.37 LED49.1
N$160
  Top 0.61: R147.2 LED49.2
N$161
  Top 0.61: R148.2 51.77,26.67 LED50.3
N$162
  Top 0.61: R149.2 51.77,39.37 LED50.1
N$163
  Top 0.61: R150.2 LED50.2
N$164
  Top 0.61: R151.2 74.63,26.67 LED51.3
N$165
  Top 0.61: R152.2 74.63,39.37 LED51.1
N$166
  Top 0.61: R153.2 LED51.2
N$167
  Top 0.61: R154.2 97.49,26.67 LED52.3
N$168
  Top 0.61: R155.2 97.49,39.37 LED52.1
N$169
  Top 0.61: R156.2 LED52.2
N$170
  Top 0.61: R157.2 120.35,26.67 LED53.3
N$171
  Top 0.61: R158.2 120.35,39.37 LED53.1
N$172
  Top 0.61: R159.2 LED53.2
N$173
  Top 0.61: R160.2 143.21,26.67 LED54.3
N$174
  Top 0.61: R161.2 143.21,39.37 LED54.1
N$175
  Top 0.61: R162.2 LED54.2
N$176
  Top 0.61: R163.2 166.07,26.67 LED55.3
N$177
  Top 0.61: R164.2 166.07,39.37 LED55.1
N$178
  Top 0.61: R165.2 LED55.2
N$179
  Top 0.61: R166.2 188.93,26.67 LED56.3
N$180
  Top 0.61: R167.2 188.93,39.37 LED56.1
N$181
  Top 0.61: R168.2 LED56.2
N$182
  Top 0.61: R178.2 97.49,3.81 LED60.3
N$183
  Top 0.61: R179.2 97.49,16.51 LED60.1
N$184
  Top 0.61: R180.2 LED60.2
N$185
  Top 0.61: R181.2 120.35,3.81 LED61.3
N$186
  Top 0.61: R182.2 120.35,16.51 LED61.1
N$187
  Top 0.61: R183.2 LED61.2
N$188
  Top 0.61: R184.2 143.21,3.81 LED62.3
N$189
  Top 0.61: R185.2 143.21,16.51 LED62.1
N$190
  Top 0.61: R186.2 LED62.2
N$191
  Top 0.61: R187.2 166.07,3.81 LED63.3
N$192
  Top 0.61: R188.2 166.07,16.51 LED63.1
N$193
  Top 0.61: R189.2 LED63.2
N$194
  Top 0.61: R190.2 188.93,3.81 LED64.3
N$195
  Top 0.61: R191.2 188.93,16.51 LED64.1
N$196
  Top 0.61: R192.2 LED64.2
N$197  (via drill 0.5 pad 1.78, 0.6 pad 1.42, 0.6 pad 1.78)  (2 unrouted)
  Top 0.61: LED7.4 173.99,168.48 | LED6.4 LED6.5 151.13,170.18 151.13,171.88 | LED5.4 LED5.5 LED5.6 128.27,171.88 v128.27,175.26 | LED4.4 LED4.5 LED4.6 105.41,171.88 v105.41,175.26 | LED3.4 LED3.5 LED3.6 82.55,171.88 v82.55,175.26 | LED2.4 LED2.5 LED2.6 59.69,171.88 v59.69,175.26 | LED1.4 LED1.5 LED1.6 36.83,171.88 v36.83,175.26 | LED6.6 151.13,171.88 | 151.13,171.88 v151.13,175.26 | v173.45,175.26 LED7.6 | 196.85,168.48 LED8.4 LED8.5 LED8.6 196.85,172.42 196.85,173.99 195.58,175.26 v194.31,175.26
  Bottom 0.813: v194.31,175.26 v173.45,175.26 v151.13,175.26 v128.27,175.26 v105.41,175.26 v82.55,175.26 v59.69,175.26 v36.83,175.26 22.86,175.26 22.86,176.53 Q1.1
N$198  (via drill 0.5 pad 1.42, 0.5 pad 1.78)
  Top 0.61: LED24.4 LED24.5 LED24.6 196.85,126.16 v196.85,134.62 | LED23.4 LED23.5 LED23.6 173.99,126.16 v173.99,134.62 | LED22.4 LED22.5 LED22.6 151.13,126.16 v151.13,134.62 | LED21.4 LED21.5 LED21.6 128.27,126.16 v128.27,134.62 | LED20.4 LED20.5 LED20.6 105.41,126.16 v105.41,134.62 | LED19.4 LED19.5 LED19.6 82.55,126.16 v82.55,134.62 | LED18.4 LED18.5 LED18.6 59.69,126.16 v59.69,134.62 | LED17.4 LED17.5 LED17.6 36.83,126.16 v36.83,134.62
  Bottom 0.61: Q3.1 19.05,130.81
  Bottom 0.813: v196.85,134.62 v173.99,134.62 v151.13,134.62 v128.27,134.62 v105.41,134.62 v82.55,134.62 v59.69,134.62 v36.83,134.62 22.86,134.62 19.05,130.81
N$199
  Bottom 0.406: R194.2 12.7,151.13
  Bottom 0.61: 12.7,151.13 13.97,152.4 Q2.2
N$200  (via drill 0.5 pad 1.78)
  Top 0.61: LED9.4 LED9.5 LED9.6 36.83,149.02 v36.83,157.48 | LED10.4 LED10.5 LED10.6 59.69,149.02 v59.69,157.48 | LED11.4 LED11.5 LED11.6 82.55,149.02 v82.55,157.48 | LED12.4 LED12.5 LED12.6 105.41,149.02 v105.41,157.48 | LED13.4 LED13.5 LED13.6 128.27,149.02 v128.27,157.48 | LED14.4 LED14.5 LED14.6 151.13,149.02 v151.13,157.48 | LED15.4 LED15.5 LED15.6 173.99,149.56 v173.99,157.48 | LED16.4 LED16.5 LED16.6 196.85,149.02 v196.85,157.48
  Bottom 0.61: Q2.1 19.05,153.67
  Bottom 0.813: v196.85,157.48 v173.99,157.48 v151.13,157.48 v128.27,157.48 v105.41,157.48 v82.55,157.48 v59.69,157.48 v36.83,157.48 22.86,157.48 19.05,153.67
N$201
  Top 0.406: R197.1 18.73,78.42 19.05,78.74 19.05,88.9 IC4.4
N$202  (via drill 0.5 pad 1.42, 0.5 pad 1.78)
  Top 0.61: LED42.4 LED42.5 LED42.6 59.69,57.58 v59.69,66.04 | LED48.4 LED48.5 LED48.6 196.85,57.58 v196.85,66.04 | LED47.4 LED47.5 LED47.6 173.45,57.15 173.99,57.15 v173.99,66.04 | LED46.4 LED46.5 LED46.6 151.13,57.58 v151.13,66.04 | LED45.4 LED45.5 LED45.6 128.27,57.58 v128.27,66.04 | LED44.4 LED44.5 LED44.6 105.41,57.58 v105.41,66.04 | LED43.4 LED43.5 LED43.6 82.55,57.58 v82.55,66.04 | LED41.4 LED41.5 LED41.6 36.83,57.58 v36.83,66.04
  Bottom 0.813: v196.85,66.04 v173.99,66.04 v151.13,66.04 v128.27,66.04 v105.41,66.04 v82.55,66.04 v59.69,66.04 v36.83,66.04 22.86,66.04 17.78,59.69 Q6.1
N$203
  Top 0.406: 12.7,92.71 R199.1
  Top 0.61: 12.7,92.71 13.97,93.98 IC4.6
N$204
  Top 0.61: IC4.7 19.05,96.52 20.32,95.25 R200.1
N$205
  Bottom 0.406: 13.97,107.95 13.97,83.82 | R195.1 16.51,110.49 15.88,109.85
  Bottom 0.61: 15.88,109.85 13.97,107.95 | 13.97,83.82 IC4.2
N$206  (via drill 0.5 pad 1.42, 0.5 pad 1.78)
  Top 0.61: LED32.4 LED32.5 LED32.6 196.85,103.3 v196.85,111.76 | LED31.4 LED31.5 LED31.6 173.99,103.3 v173.99,111.76 | LED30.4 LED30.5 LED30.6 151.13,103.3 v151.13,111.76 | LED29.4 LED29.5 LED29.6 128.27,103.3 v128.27,111.76 | LED28.4 LED28.5 LED28.6 105.41,103.3 v105.41,111.76 | 82.55,101.6 LED27.5 | LED27.5 LED27.4 | LED27.5 LED27.6 82.55,103.3 v82.55,111.76 | LED26.4 LED26.5 LED26.6 59.69,103.3 v59.69,111.76 | LED25.4 LED25.5 LED25.6 36.83,103.3 v36.83,111.76
  Bottom 0.61: Q4.1 19.05,107.95
  Bottom 0.813: v196.85,111.76 v173.99,111.76 v151.13,111.76 v128.27,111.76 v105.41,111.76 v82.55,111.76 v59.69,111.76 v36.83,111.76 22.86,111.76 19.05,107.95
N$207  (via drill 0.5 pad 1.42, 0.5 pad 1.78)
  Top 0.61: R3.1 v24.13,170.18 | R51.1 v24.13,124.46 | R75.1 v24.13,101.6 | R99.1 v24.13,78.74 | R123.1 v24.13,55.88 | R147.1 v24.13,33.02 | R171.1 v24.13,10.16 | v41.91,10.16 v41.91,33.02 v41.91,55.88 v41.91,78.74 v41.91,101.6 v41.91,124.46 v41.91,147.32 v41.91,170.18 v41.91,179.07 | v24.13,147.32 R27.1
  Bottom 0.406: 44.45,189.23 49.53,189.23
  Bottom 0.61: v41.91,179.07 41.91,185.42 44.45,189.23 | 49.53,189.23 50.8,190.5 IC1.15
  Bottom 0.813: v24.13,170.18 v41.91,170.18 | v41.91,147.32 v24.13,147.32 | v24.13,124.46 v41.91,124.46 | v24.13,101.6 v41.91,101.6 | v24.13,78.74 v41.91,78.74 | v24.13,55.88 v41.91,55.88 | v24.13,33.02 v41.91,33.02 | v24.13,10.16 v41.91,10.16
N$208
  Bottom 0.406: IC4.1 12.7,81.28 R194.1
N$209
  Bottom 0.61: IC4.3 19.05,86.36 20.32,87.63 R196.1
N$210  (via drill 0.5 pad 1.42, 0.5 pad 1.78)
  Top 0.61: LED40.4 LED40.5 LED40.6 196.85,80.44 v196.85,88.9 | LED39.4 LED39.5 LED39.6 173.45,80.01 173.99,80.01 v173.99,88.9 | LED38.4 LED38.5 LED38.6 151.13,80.44 v151.13,88.9 | LED37.4 128.27,77.04 128.27,77.47 127.73,77.47 LED37.5 LED37.6 128.27,80.44 v128.27,88.9 | LED36.4 LED36.5 LED36.6 105.41,80.44 v105.41,88.9 | LED35.4 LED35.5 LED35.6 82.55,80.44 v82.55,88.9 | LED34.4 LED34.5 LED34.6 59.69,80.44 v59.69,88.9 | LED33.4 LED33.5 LED33.6 36.83,80.44 v36.83,88.9
  Bottom 0.61: Q5.1 19.05,74.93
  Bottom 0.813: v196.85,88.9 v173.99,88.9 v151.13,88.9 v128.27,88.9 v105.41,88.9 v82.55,88.9 v59.69,88.9 v36.83,88.9 22.86,88.9 21.59,87.63 21.59,77.47 19.05,74.93
N$211
  Top 0.61: IC1.1 29.21,184.15 25.72,179.39 R2.1 22.86,176.53 22.86,172.72 21.59,171.45 21.59,168.91 22.86,167.64 22.86,153.67 | R26.1 22.86,153.67 | R50.1 22.86,130.81 | R74.1 22.86,107.95 | R98.1 22.86,85.09 | R122.1 22.86,62.23 | R146.1 22.86,39.37 | R170.1 22.86,16.51 22.86,30.48 21.59,31.75 21.59,34.29 22.86,35.56 22.86,39.37 | 22.86,153.67 22.86,149.86 21.59,148.59 21.59,146.05 22.86,144.78 22.86,130.81 | 22.86,107.95 22.86,121.92 21.59,123.19 21.59,125.73 22.86,127 22.86,130.81 | 22.86,85.09 22.86,99.06 21.59,100.33 21.59,102.87 22.86,104.14 22.86,107.95 | 22.86,62.23 22.86,76.2 21.59,77.47 21.59,80.01 22.86,81.28 22.86,85.09 | 22.86,62.23 22.86,58.42 21.59,57.15 21.59,54.61 22.86,53.34 22.86,39.37
N$212  (1 unrouted)
  Top 0.61: R1.1 25.72,162.24 26.67,161.29 39.37,161.29 | 39.37,161.29 39.37,138.43 | 39.37,138.43 26.67,138.43 25.72,139.38 R25.1 | 39.37,115.57 26.67,115.57 25.72,116.52 R49.1 | 39.37,115.57 39.37,138.43 | R73.1 25.72,93.66 26.67,92.71 39.37,92.71 | 39.37,92.71 39.37,115.57 | 39.37,161.29 39.37,180.34 40.64,181.61 43.18,181.61 44.45,180.34 49.53,180.34 50.8,181.61 IC1.2 | R121.1 25.72,47.94 26.67,46.99 39.37,46.99 | 39.37,46.99 39.37,69.85 | 39.37,69.85 26.67,69.85 25.72,70.8 R97.1 | R145.1 25.72,25.08 26.67,24.13 39.37,24.13 | 39.37,24.13 39.37,46.99 | R169.1 25.72,2.22 26.67,1.27 39.37,1.27 39.37,24.13 | 39.37,92.71 39.37,69.85
N$213  (via drill 0.5 pad 1.42, 0.5 pad 1.78)
  Top 0.61: R30.1 v46.99,147.32 | R54.1 v46.99,124.46 | R150.1 v46.99,33.02 | R78.1 v46.99,101.6 | R102.1 v46.99,78.74 | R126.1 v46.99,55.88 | v64.77,177.8 v64.77,170.18 v64.77,147.32 v64.77,124.46 v64.77,101.6 v64.77,78.74 v64.77,55.88 v64.77,33.02 v64.77,10.16 | R174.1 v46.99,10.16 | v46.99,170.18 R6.1
  Bottom 0.61: IC1.3 53.34,179.07 54.61,177.8 v64.77,177.8
  Bottom 0.813: v46.99,147.32 v64.77,147.32 | v64.77,170.18 v46.99,170.18 | v46.99,124.46 v64.77,124.46 | v46.99,101.6 v64.77,101.6 | v46.99,78.74 v64.77,78.74 | v46.99,55.88 v64.77,55.88 | v46.99,33.02 v64.77,33.02 | v46.99,10.16 v64.77,10.16
N$214  (via drill 0.5 pad 1.42, 0.5 pad 1.78)
  Top 0.61: LED64.4 LED64.5 LED64.6 196.85,11.86 v196.85,20.32 | LED63.4 LED63.5 LED63.6 173.99,12.4 v173.99,20.32 | LED62.4 LED62.5 LED62.6 151.13,11.86 v151.13,20.32 | LED61.4 LED61.5 LED61.6 128.27,11.86 v128.27,20.32 | LED60.4 LED60.5 LED60.6 105.41,11.86 v105.41,20.32 | LED59.4 LED59.5 LED59.6 82.55,11.86 v82.55,20.32 | LED58.6 LED58.5 LED58.4 59.69,8.46 v59.69,20.32 | LED57.4 LED57.5 LED57.6 36.83,11.86 v36.83,20.32
  Bottom 0.813: v196.85,20.32 v173.99,20.32 v151.13,20.32 v128.27,20.32 v105.41,20.32 v82.55,20.32 v59.69,20.32 v36.83,20.32 22.86,20.32 17.78,13.97 Q8.1
N$215
  Top 0.406: 13.97,90.17 R198.1
  Top 0.61: 13.97,90.17 15.24,91.44 IC4.5
N$216  (via drill 0.5 pad 1.42, 0.5 pad 1.78)
  Top 0.61: LED50.4 LED50.5 LED50.6 59.69,34.72 v59.69,43.18 | LED56.4 LED56.5 LED56.6 196.85,34.72 v196.85,43.18 | LED55.4 LED55.5 LED55.6 173.45,34.29 173.99,34.29 v173.99,43.18 | LED54.4 150.59,32.48 151.13,33.02 LED54.5 LED54.6 151.13,34.72 v151.13,43.18 | LED53.4 LED53.5 LED53.6 128.27,34.72 v128.27,43.18 | LED52.4 LED52.5 LED52.6 105.41,34.72 v105.41,43.18 | LED51.4 LED51.5 LED51.6 82.55,34.72 v82.55,43.18 | LED49.6 LED49.5 LED49.4 36.83,31.32 v36.83,43.18
  Bottom 0.813: v196.85,43.18 v173.99,43.18 v151.13,43.18 v128.27,43.18 v105.41,43.18 v82.55,43.18 v59.69,43.18 v36.83,43.18 22.86,43.18 17.78,38.1 Q7.1
N$217
  Top 0.61: IC1.4 55.88,180.34 54.61,179.07 49.53,179.07 48.58,176.85 R5.1 45.72,176.53 44.45,175.26 44.45,153.67 | R29.1 44.45,153.67 | 44.45,153.67 44.45,130.81 | R53.1 44.45,130.81 | 44.45,130.81 44.45,107.95 | R77.1 44.45,107.95 | 44.45,107.95 44.45,85.09 | R101.1 44.45,85.09 | 44.45,85.09 44.45,62.23 | R125.1 44.45,62.23 | 44.45,62.23 44.45,39.37 | R149.1 44.45,39.37 | 44.45,39.37 44.45,16.51 R173.1
N$218
  Top 0.61: R28.1 48.58,139.38 49.53,138.43 62.23,138.43 | 62.23,138.43 62.23,115.57 | 62.23,115.57 49.53,115.57 48.58,116.52 R52.1 | R4.1 48.58,162.24 49.53,161.29 62.23,161.29 | 62.23,161.29 62.23,138.43 | IC1.5 58.42,181.61 62.23,179.07 62.23,161.29 | R124.1 48.58,47.94 49.53,46.99 62.23,46.99 | 62.23,46.99 62.23,69.85 | 62.23,69.85 62.23,92.71 | 62.23,92.71 62.23,115.57 | R100.1 48.58,70.8 49.53,69.85 62.23,69.85 | R172.1 48.58,2.22 49.53,1.27 62.23,1.27 62.23,24.13 | 62.23,24.13 49.53,24.13 48.58,25.08 R148.1 | 62.23,46.99 62.23,24.13 | R76.1 48.58,93.66 49.53,92.71 62.23,92.71
N$219  (via drill 0.5 pad 1.42, 0.5 pad 1.78)  (1 unrouted)
  Top 0.406: 87.63,186.69 62.23,186.69
  Top 0.61: R9.1 v69.85,170.18 | 87.63,186.69 v87.63,170.18 v87.63,147.32 v87.63,124.46 v87.63,101.6 v87.63,78.74 v87.63,55.88 v87.63,33.02 v87.63,10.16 | 62.23,186.69 60.96,185.42 IC1.6 | R33.1 v69.85,147.32 | R81.1 v69.85,101.6 | R105.1 v69.85,78.74 | R129.1 v69.85,55.88 | R153.1 v69.85,33.02 | R177.1 v69.85,10.16 | v69.85,124.46 R57.1
  Bottom 0.813: v69.85,170.18 v87.63,170.18 | v69.85,147.32 v87.63,147.32 | v69.85,124.46 v87.63,124.46 | v69.85,101.6 v87.63,101.6 | v69.85,78.74 v87.63,78.74 | v69.85,55.88 v87.63,55.88 | v69.85,33.02 v87.63,33.02 | v69.85,10.16 v87.63,10.16
N$220  (1 unrouted)
  Top 0.61: 67.31,153.67 67.31,176.53 R8.1 71.44,178.75 69.85,180.34 66.04,180.34 63.5,181.61 IC1.7 | 67.31,153.67 67.31,130.81 | R56.1 67.31,130.81 | 67.31,130.81 67.31,107.95 | R80.1 67.31,107.95 | 67.31,107.95 67.31,85.09 | R104.1 67.31,85.09 | 67.31,85.09 67.31,62.23 | R128.1 67.31,62.23 | 67.31,62.23 67.31,39.37 | 69.85,39.37 67.31,39.37 | 67.31,39.37 67.31,16.51 R176.1 | R32.1 67.31,153.67
N$221  (via drill 0.5 pad 1.78)
  Top 0.61: R7.1 71.44,162.24 72.39,161.29 85.09,161.29 | 85.09,161.29 v85.09,184.15 | R31.1 71.44,139.38 72.39,138.43 85.09,138.43 | 85.09,138.43 85.09,161.29 | R79.1 71.44,93.66 72.39,92.71 85.09,92.71 | 85.09,92.71 85.09,115.57 | 85.09,115.57 85.09,138.43 | R55.1 71.44,116.52 72.39,115.57 85.09,115.57 | R175.1 71.44,2.22 72.39,1.27 85.09,1.27 85.09,24.13 | 85.09,24.13 72.39,24.13 71.44,25.08 R151.1 | R127.1 71.44,47.94 72.39,46.99 85.09,46.99 | 85.09,46.99 85.09,24.13 | R103.1 71.44,70.8 72.39,69.85 85.09,69.85 | 85.09,69.85 85.09,46.99 | 85.09,92.71 85.09,69.85
  Bottom 0.406: 90.17,189.23 101.6,189.23
  Bottom 0.61: v85.09,184.15 90.17,189.23 | 101.6,189.23 102.87,190.5 IC2.15
N$222  (via drill 0.5 pad 1.42, 0.5 pad 1.78)
  Top 0.406: v138.43,33.02 R162.1
  Top 0.61: R18.1 v138.43,170.18 | v156.21,177.8 v156.21,170.18 v156.21,147.32 v156.21,124.46 v156.21,101.6 v156.21,78.74 v156.21,55.88 v156.21,33.02 v156.21,10.16 | R42.1 v138.43,147.32 | R66.1 v138.43,124.46 | R90.1 v138.43,101.6 | R114.1 v138.43,78.74 | R186.1 v138.43,10.16 | R138.1 v138.43,55.88
  Bottom 0.61: IC2.7 115.57,181.61 116.84,180.34 153.67,180.34 v156.21,177.8
  Bottom 0.813: v138.43,170.18 v156.21,170.18 | v138.43,147.32 v156.21,147.32 | v138.43,124.46 v156.21,124.46 | v138.43,101.6 v156.21,101.6 | v138.43,78.74 v156.21,78.74 | v138.43,10.16 v156.21,10.16 | v156.21,33.02 v138.43,33.02 | v138.43,55.88 v156.21,55.88
N$223  (via drill 0.5 pad 1.78)
  Top 0.61: R10.1 94.3,162.24 95.25,161.29 107.95,161.29 | 107.95,161.29 v107.95,177.8 | R34.1 94.3,139.38 95.25,138.43 107.95,138.43 | 107.95,138.43 107.95,161.29 | R58.1 94.3,116.52 95.25,115.57 107.95,115.57 | 107.95,115.57 107.95,138.43 | R82.1 94.3,93.66 95.25,92.71 107.95,92.71 | 107.95,92.71 107.95,115.57 | R106.1 94.3,70.8 95.25,69.85 107.95,69.85 | 107.95,69.85 107.95,92.71 | R130.1 94.3,47.94 95.25,46.99 107.95,46.99 | 107.95,46.99 107.95,69.85 | R154.1 94.3,25.08 95.25,24.13 107.95,24.13 | 107.95,24.13 107.95,46.99 | R178.1 94.3,2.22 95.25,1.27 107.95,1.27 107.95,24.13
  Bottom 0.61: v107.95,177.8 105.41,180.34 IC2.3
N$224  (via drill 0.5 pad 1.42, 0.5 pad 1.78)
  Top 0.61: R12.1 v92.71,170.18 | R36.1 v92.71,147.32 | R60.1 v92.71,124.46 | R84.1 v92.71,101.6 | R156.1 v92.71,33.02 | R108.1 v92.71,78.74 | R132.1 v92.71,55.88 | R180.1 v92.71,10.16 | v110.49,10.16 v110.49,33.02 v110.49,55.88 v110.49,78.74 v110.49,101.6 v110.49,124.46 v110.49,147.32 v110.49,170.18 110.49,179.07 109.22,180.34 101.6,180.34 100.33,181.61 IC2.1
  Bottom 0.813: v92.71,170.18 v110.49,170.18 | v92.71,147.32 v110.49,147.32 | v92.71,124.46 v110.49,124.46 | v92.71,101.6 v110.49,101.6 | v92.71,78.74 v110.49,78.74 | v92.71,55.88 v110.49,55.88 | v92.71,33.02 v110.49,33.02 | v92.71,10.16 v110.49,10.16
N$225  (via drill 0.5 pad 1.42, 0.5 pad 1.78)
  Top 0.406: 132.08,186.69 107.95,186.69
  Top 0.61: R159.1 v115.57,33.02 | R15.1 v115.57,170.18 | 132.08,186.69 133.35,185.42 v133.35,170.18 v133.35,147.32 v133.35,124.46 v133.35,101.6 v133.35,78.74 v133.35,55.88 v133.35,33.02 v133.35,10.16 | 107.95,186.69 IC2.4 | R63.1 v114.3,124.46 | v115.57,147.32 R39.1 | R87.1 v115.57,101.6 | R111.1 v115.57,78.74 | R135.1 v115.57,55.88 | R183.1 v115.57,10.16
  Bottom 0.813: v115.57,33.02 v133.35,33.02 | v114.3,124.46 v133.35,124.46 | v133.35,147.32 v115.57,147.32 | v115.57,170.18 v133.35,170.18 | v115.57,101.6 v133.35,101.6 | v115.57,78.74 v133.35,78.74 | v115.57,55.88 v133.35,55.88 | v115.57,10.16 v133.35,10.16
N$226
  Top 0.61: IC2.5 110.49,181.61 113.03,179.07 113.03,176.53 | 113.03,176.53 113.03,153.67 | R38.1 113.03,153.67 | 113.03,153.67 113.03,130.81 | R62.1 113.03,130.81 | 113.03,130.81 113.03,107.95 | 113.03,107.95 113.03,85.09 | R110.1 113.03,85.09 | 113.03,85.09 113.03,62.23 | R134.1 113.03,62.23 | 113.03,62.23 113.03,39.37 | R158.1 113.03,39.37 | 113.03,39.37 113.03,16.51 R182.1 | 113.03,107.95 R86.1 | 113.03,176.53 R14.1
N$227
  Top 0.61: R13.1 117.16,162.24 118.11,161.29 130.81,161.29 | 130.81,161.29 130.81,138.43 | IC2.6 113.03,181.61 115.57,179.07 130.81,179.07 130.81,161.29 | R181.1 117.16,2.22 118.11,1.27 130.81,1.27 130.81,24.13 | 130.81,24.13 118.11,24.13 117.16,25.08 R157.1 | R133.1 117.16,47.94 118.11,46.99 130.81,46.99 | 130.81,46.99 130.81,24.13 | R109.1 117.16,70.8 118.11,69.85 130.81,69.85 | 130.81,69.85 130.81,46.99 | R85.1 117.16,93.66 118.11,92.71 130.81,92.71 | 130.81,92.71 130.81,69.85 | R61.1 117.16,116.52 118.11,115.57 130.81,115.57 | 130.81,115.57 130.81,92.71 | 130.81,138.43 118.11,138.43 117.16,139.38 R37.1 | 130.81,138.43 130.81,115.57
N$228
  Top 0.61: 135.89,153.67 135.89,175.26 137.16,176.53 R17.1 140.02,184.47 143.51,187.96 156.21,187.96 IC3.15 | 135.89,62.23 135.89,85.09 | R113.1 135.89,85.09 | 135.89,85.09 135.89,107.95 | 135.89,107.95 R89.1 | R41.1 135.89,153.67 | 135.89,153.67 135.89,130.81 | 135.89,130.81 R65.1 | 135.89,130.81 135.89,107.95 | R137.1 135.89,62.23 | 135.89,62.23 135.89,39.37 | R161.1 135.89,39.37 | 135.89,39.37 135.89,16.51 R185.1
N$229
  Top 0.61: R16.1 140.02,162.24 140.97,161.29 153.67,161.29 | 153.67,161.29 IC3.1 | R136.1 140.02,47.94 140.97,46.99 153.67,46.99 | 153.67,46.99 153.67,69.85 | 153.67,69.85 140.97,69.85 140.02,70.8 R112.1 | R40.1 140.02,139.38 140.97,138.43 153.67,138.43 | 153.67,138.43 153.67,161.29 | R64.1 140.02,116.52 140.97,115.57 153.67,115.57 | 153.67,115.57 153.67,138.43 | R88.1 140.02,93.66 140.97,92.71 153.67,92.71 | 153.67,92.71 153.67,115.57 | 153.67,92.71 153.67,69.85 | R160.1 140.02,25.08 140.97,24.13 153.67,24.13 | 153.67,24.13 153.67,46.99 | R184.1 140.02,2.22 140.97,1.27 153.67,1.27 153.67,24.13
N$230  (via drill 0.5, 0.5 pad 1.42, 0.5 pad 1.78)
  Top 0.61: R21.1 v161.29,170.18 | R45.1 v161.29,147.32 | R69.1 v161.29,124.46 | R93.1 v161.29,101.6 | R117.1 v161.29,78.74 | R141.1 v161.29,55.88 | R165.1 v161.29,33.02 | R189.1 v161.29,10.16 | v179.07,10.16 v179.07,33.02 v179.07,55.88 v179.07,78.74 v179.07,101.6 v179.07,124.46 v179.07,147.32 v179.07,170.18 v179.07,180.34
  Bottom 0.61: v179.07,180.34 157.48,180.34 156.21,181.61 IC3.2
  Bottom 0.813: v161.29,147.32 v179.07,147.32 | v161.29,124.46 v179.07,124.46 | v161.29,101.6 v179.07,101.6 | v161.29,78.74 v179.07,78.74 | v161.29,55.88 v179.07,55.88 | v161.29,33.02 v179.07,33.02 | v161.29,10.16 v179.07,10.16 | v161.29,170.18 v179.07,170.18
N$231
  Top 0.61: 158.75,176.53 IC3.3 | R20.1 158.75,176.53 | 158.75,176.53 158.75,175.26 158.75,153.67 | R44.1 158.75,153.67 | 158.75,153.67 158.75,130.81 | R68.1 158.75,130.81 | 158.75,130.81 158.75,107.95 | R92.1 158.75,107.95 | 158.75,107.95 158.75,85.09 | 158.75,85.09 R116.1 | 158.75,85.09 158.75,62.23 | R140.1 158.75,62.23 | 158.75,62.23 158.75,39.37 | R164.1 158.75,39.37 | 158.75,39.37 158.75,16.51 R188.1
N$232
  Top 0.61: R19.1 162.88,162.24 163.83,161.29 176.53,161.29 | 176.53,161.29 176.53,177.8 175.26,179.07 162.56,179.07 161.29,180.34 IC3.4 | R67.1 162.88,116.52 163.83,115.57 176.53,115.57 | 176.53,115.57 176.53,138.43 | 176.53,138.43 176.53,161.29 | R115.1 162.88,70.8 163.83,69.85 176.53,69.85 | 176.53,69.85 176.53,92.71 | 176.53,92.71 176.53,115.57 | R187.1 162.88,2.22 163.83,1.27 176.53,1.27 176.53,24.13 | R43.1 162.88,139.38 163.83,138.43 176.53,138.43 | R91.1 162.88,93.66 163.83,92.71 176.53,92.71 | R139.1 162.88,47.94 163.83,46.99 176.53,46.99 | 176.53,46.99 176.53,69.85 | 176.53,24.13 163.83,24.13 162.88,25.08 R163.1 | 176.53,24.13 176.53,46.99
N$233  (via drill 0.5 pad 1.42, 0.5 pad 1.78)  (1 unrouted)
  Top 0.406: v184.15,33.02 R168.1 | v184.15,101.6 R96.1
  Top 0.61: R24.1 v184.15,170.18 | IC3.5 163.83,185.42 165.1,187.96 198.12,187.96 199.39,186.69 v199.39,170.18 v199.39,147.32 v199.39,124.46 v199.39,101.6 v199.39,78.74 v199.39,55.88 v199.39,33.02 v199.39,10.16 | R192.1 v184.15,10.16 | R72.1 v184.15,124.46 | v184.15,78.74 185.42,78.74 | R144.1 v184.15,55.88 | R48.1 v184.15,147.32
  Bottom 0.813: v184.15,170.18 v199.39,170.18 | v184.15,10.16 v199.39,10.16 | v184.15,124.46 v199.39,124.46 | v184.15,101.6 v199.39,101.6 | v199.39,78.74 v184.15,78.74 | v184.15,55.88 v199.39,55.88 | v184.15,33.02 v199.39,33.02 | v184.15,147.32 v199.39,147.32
N$234
  Top 0.406: 166.37,181.61 173.99,181.61
  Top 0.61: 166.37,181.61 IC3.6 | 181.61,62.23 181.61,85.09 | R119.1 181.61,85.09 | 181.61,85.09 181.61,107.95 | R95.1 181.61,107.95 | 181.61,107.95 181.61,130.81 | 181.61,130.81 R71.1 | 181.61,153.67 181.61,175.26 182.88,176.53 R23.1 185.74,181.29 182.88,184.15 176.53,184.15 173.99,181.61 | R47.1 181.61,153.67 | 181.61,153.67 181.61,130.81 | R143.1 181.61,62.23 | 181.61,62.23 181.61,39.37 | R167.1 181.61,39.37 | 181.61,39.37 181.61,16.51 R191.1
N$235
  Top 0.406: 198.12,185.42 198.12,161.29 198.12,138.43 198.12,115.57 198.12,92.71 198.12,69.85 198.12,46.99 198.12,24.13 198.12,6.35 | 196.85,186.69 170.18,186.69
  Top 0.61: R190.1 184.15,3.49 184.15,2.54 185.42,1.27 189.23,1.27 193.04,6.35 198.12,6.35 | 198.12,46.99 186.69,46.99 185.42,47.94 R142.1 | R22.1 185.74,162.24 186.69,161.29 198.12,161.29 | 198.12,185.42 196.85,186.69 | 170.18,186.69 IC3.7 | R46.1 185.74,139.38 186.69,138.43 198.12,138.43 | R70.1 185.74,116.52 186.69,115.57 198.12,115.57 | R94.1 185.74,93.66 186.69,92.71 198.12,92.71 | R166.1 185.74,25.08 186.69,24.13 198.12,24.13 | R118.1 185.74,70.8 186.69,69.85 198.12,69.85
N$236
  Top 0.406: 123.19,194.31 157.48,194.31
  Top 0.61: IC2.9 120.65,191.77 123.19,194.31 | 157.48,194.31 158.75,193.04 IC3.14
N$239
  Bottom 0.61: R195.2 16.51,124.46 15.24,125.73 15.24,128.91 Q3.2
N$240
  Top 0.406: 67.31,189.23 104.14,189.23
  Top 0.61: IC1.9 66.04,190.5 67.31,189.23 | 104.14,189.23 105.41,190.5 IC2.14
N$241
  Bottom 0.61: R196.2 20.32,100.33 19.05,101.6 16.51,101.6 15.24,102.87 15.24,106.05 Q4.2
N$242
  Top 0.61: R197.2 16.51,77.47 15.24,76.2 15.24,74.29 Q5.2
N$243
  Top 0.406: R198.2 13.97,52.7 Q6.2
N$244
  Top 0.406: R199.2 12.7,33.02
  Top 0.61: 12.7,33.02 15.24,30.48 15.24,28.58 Q7.2
N$245
  Bottom 0.406: R193.1 11.43,83.82 IC4.15
N$246
  Bottom 0.406: R193.2 11.43,161.29 12.7,162.56 20.32,162.56 21.59,163.83 21.59,167.64 20.32,168.91 16.51,168.91 15.24,170.18
  Bottom 0.61: 15.24,175.26 Q1.2 15.24,174.62 15.24,170.18
S$1
  Top 0.61: 1.27,196.85 0,196.85 0,195.58
S$2
  Top 0.61: 199.39,196.85 200.66,196.85 200.66,195.58
S$3
  Top 0.61: 199.39,0 200.66,0 200.66,1.27
S$4
  Top 0.61: 1.27,0 0,0 0,1.27
S$5
  Bottom 0.61: 199.39,196.85 200.66,196.85 200.66,195.58
S$6
  Bottom 0.61: 199.39,0 200.66,0 200.66,1.27
S$7
  Bottom 0.61: 1.27,0 0,0 0,1.27
S$8
  Bottom 0.61: 0,195.58 0,196.85 1.27,196.85
(copper drawn outside any net)
  shapes: Bottom area x45, Bottom circle x4, Top area x232, Top circle x4